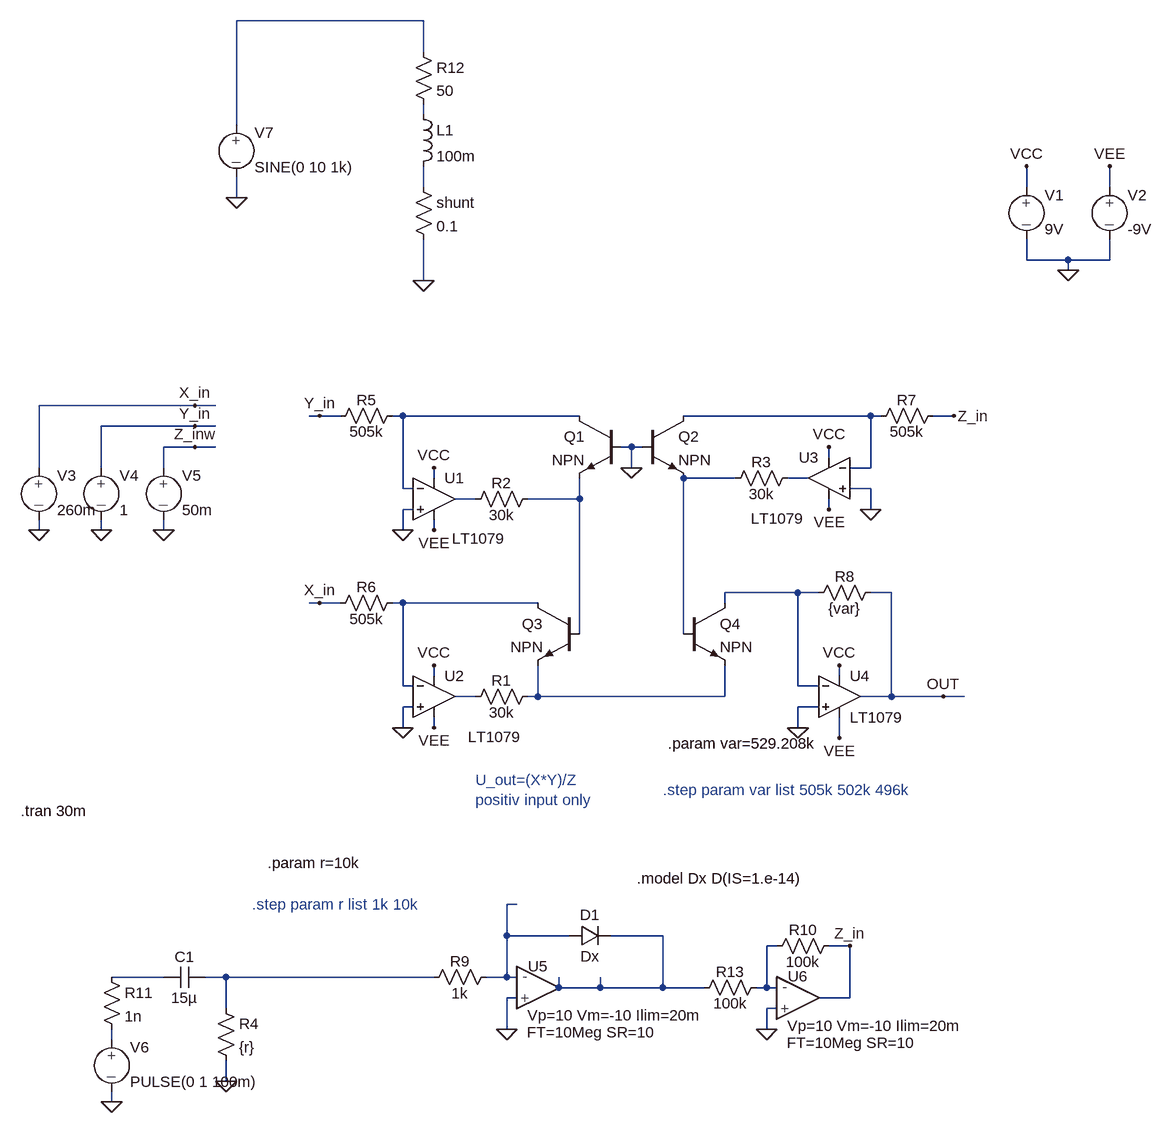
[diagram p0: schematic Multiplier.asc]
Multiplier.asc, the LTspice schematic file:
Version 4
SHEET 1 936 1044
WIRE -192 -640 -480 -640
WIRE -192 -592 -192 -640
WIRE -192 -496 -192 -512
WIRE -480 -480 -480 -640
WIRE -192 -384 -192 -416
WIRE 736 -384 736 -416
WIRE 864 -384 864 -416
WIRE -480 -368 -480 -400
WIRE 736 -272 736 -304
WIRE 800 -272 736 -272
WIRE 864 -272 864 -304
WIRE 864 -272 800 -272
WIRE 800 -256 800 -272
WIRE -192 -240 -192 -304
WIRE -544 -48 -784 -48
WIRE -512 -48 -544 -48
WIRE -352 -32 -368 -32
WIRE -320 -32 -352 -32
WIRE -224 -32 -240 -32
WIRE 48 -32 -224 -32
WIRE 496 -32 208 -32
WIRE 512 -32 496 -32
WIRE 624 -32 592 -32
WIRE -544 -16 -688 -16
WIRE -512 -16 -544 -16
WIRE -544 16 -592 16
WIRE -512 16 -544 16
WIRE 128 16 112 16
WIRE 144 16 128 16
WIRE 432 32 432 16
WIRE -784 48 -784 -48
WIRE -688 48 -688 -16
WIRE -592 48 -592 16
WIRE 128 48 128 16
WIRE 496 48 496 -32
WIRE 496 48 464 48
WIRE -176 64 -176 48
WIRE 288 64 208 64
WIRE 400 64 368 64
WIRE -224 80 -224 -32
WIRE -208 80 -224 80
WIRE 496 80 464 80
WIRE -112 96 -144 96
WIRE 48 96 48 64
WIRE 48 96 -32 96
WIRE -208 112 -224 112
WIRE 432 112 432 96
WIRE 496 112 496 80
WIRE -784 144 -784 128
WIRE -688 144 -688 128
WIRE -592 144 -592 128
WIRE -224 144 -224 112
WIRE -176 144 -176 128
WIRE 384 240 272 240
WIRE 416 240 384 240
WIRE 528 240 496 240
WIRE -352 256 -368 256
WIRE -320 256 -352 256
WIRE -224 256 -240 256
WIRE -16 256 -224 256
WIRE 272 256 272 240
WIRE 48 304 48 96
WIRE 208 304 208 64
WIRE -176 368 -176 352
WIRE 448 368 448 352
WIRE -224 384 -224 256
WIRE -208 384 -224 384
WIRE 384 384 384 240
WIRE 416 384 384 384
WIRE -112 400 -144 400
WIRE -16 400 -16 352
WIRE -16 400 -32 400
WIRE 272 400 272 352
WIRE 272 400 -16 400
WIRE 528 400 528 240
WIRE 528 400 480 400
WIRE 608 400 528 400
WIRE 640 400 608 400
WIRE -208 416 -224 416
WIRE 416 416 384 416
WIRE -224 448 -224 416
WIRE -176 448 -176 432
WIRE 384 448 384 416
WIRE 448 464 448 432
WIRE -48 720 -64 720
WIRE -64 768 -64 720
WIRE 32 768 -64 768
WIRE 176 768 96 768
WIRE 352 784 336 784
WIRE 464 784 432 784
WIRE -592 832 -672 832
WIRE -496 832 -528 832
WIRE -176 832 -496 832
WIRE -64 832 -64 768
WIRE -64 832 -96 832
WIRE -48 832 -64 832
WIRE 16 848 16 832
WIRE 80 848 80 832
WIRE 80 848 16 848
WIRE 176 848 176 768
WIRE 176 848 80 848
WIRE 240 848 176 848
WIRE 336 848 336 784
WIRE 336 848 320 848
WIRE 352 848 336 848
WIRE -48 864 -64 864
WIRE 464 864 464 784
WIRE 464 864 416 864
WIRE -496 880 -496 832
WIRE 352 880 336 880
WIRE -64 912 -64 864
WIRE 336 912 336 880
WIRE -672 928 -672 912
WIRE -496 992 -496 960
WIRE -672 1024 -672 1008
FLAG 128 48 0
FLAG 800 -256 0
FLAG -224 448 0
FLAG -224 144 0
FLAG 384 448 0
FLAG 496 112 0
FLAG 736 -416 VCC
FLAG 432 16 VCC
FLAG 448 352 VCC
FLAG -176 352 VCC
FLAG -176 48 VCC
FLAG -176 144 VEE
FLAG -176 448 VEE
FLAG 432 112 VEE
FLAG 448 464 VEE
FLAG 608 400 OUT
FLAG -352 -32 Y_in
FLAG 624 -32 Z_in
FLAG -352 256 X_in
FLAG -592 144 0
FLAG -688 144 0
FLAG -784 144 0
FLAG -544 -48 X_in
FLAG -544 -16 Y_in
FLAG -544 16 Z_inw
FLAG 864 -416 VEE
FLAG -64 912 0
FLAG -496 992 0
FLAG -672 1024 0
FLAG 336 912 0
FLAG 464 784 Z_in
FLAG -480 -368 0
FLAG -192 -240 0
SYMBOL Opamps\\LT1079 -176 32 R0
WINDOW 3 28 125 Left 0
SYMATTR InstName U1
SYMBOL Opamps\\LT1079 -176 336 R0
WINDOW 3 52 126 Left 0
SYMATTR InstName U2
SYMBOL Opamps\\LT1079 432 0 M0
WINDOW 3 38 126 Left 0
SYMATTR InstName U3
SYMBOL Opamps\\LT1079 448 336 R0
SYMATTR InstName U4
SYMBOL EIT_Semiconductors\\npn 112 -32 M0
SYMATTR InstName Q1
SYMBOL EIT_Semiconductors\\npn 144 -32 R0
SYMATTR InstName Q2
SYMBOL EIT_Semiconductors\\npn 48 256 M0
SYMATTR InstName Q3
SYMBOL EIT_Semiconductors\\npn 208 256 R0
SYMATTR InstName Q4
SYMBOL res -128 416 R270
WINDOW 0 25 56 VTop 0
WINDOW 3 7 56 VBottom 0
SYMATTR InstName R1
SYMATTR Value 30k
SYMBOL res -128 112 R270
WINDOW 0 25 56 VTop 0
WINDOW 3 7 56 VBottom 0
SYMATTR InstName R2
SYMATTR Value 30k
SYMBOL res 272 80 R270
WINDOW 0 25 56 VTop 0
WINDOW 3 7 56 VBottom 0
SYMATTR InstName R3
SYMATTR Value 30k
SYMBOL res -224 -48 R90
WINDOW 0 7 56 VBottom 0
WINDOW 3 25 56 VTop 0
SYMATTR InstName R5
SYMATTR Value 505k
SYMBOL res -224 240 R90
WINDOW 0 7 56 VBottom 0
WINDOW 3 25 56 VTop 0
SYMATTR InstName R6
SYMATTR Value 505k
SYMBOL res 608 -48 R90
WINDOW 0 7 56 VBottom 0
WINDOW 3 25 56 VTop 0
SYMATTR InstName R7
SYMATTR Value 505k
SYMBOL res 512 224 R90
WINDOW 0 7 56 VBottom 0
WINDOW 3 25 56 VTop 0
SYMATTR InstName R8
SYMATTR Value {var}
SYMBOL source-V 736 -400 R0
WINDOW 123 0 0 Left 0
WINDOW 39 0 0 Left 0
SYMATTR InstName V1
SYMATTR Value 9V
SYMBOL source-V 864 -400 R0
SYMATTR InstName V2
SYMATTR Value -9V
SYMBOL source-V -784 32 R0
WINDOW 123 0 0 Left 0
WINDOW 39 0 0 Left 0
SYMATTR InstName V3
SYMATTR Value 260m
SYMBOL source-V -688 32 R0
SYMATTR InstName V4
SYMATTR Value 1
SYMBOL source-V -592 32 R0
SYMATTR InstName V5
SYMATTR Value 50m
SYMBOL source-V -672 912 R0
WINDOW 123 0 0 Left 0
WINDOW 39 0 0 Left 0
SYMATTR InstName V6
SYMATTR Value PULSE(0 1 100m)
SYMBOL cap -528 816 R90
WINDOW 0 0 32 VBottom 0
WINDOW 3 32 32 VTop 0
SYMATTR InstName C1
SYMATTR Value 15µ
SYMBOL res -512 864 R0
SYMATTR InstName R4
SYMATTR Value {r}
SYMBOL res -80 816 R90
WINDOW 0 7 56 VBottom 0
WINDOW 3 25 56 VTop 0
SYMATTR InstName R9
SYMATTR Value 1k
SYMBOL res -688 816 R0
SYMATTR InstName R11
SYMATTR Value 1n
SYMBOL EIT_Semiconductors\\op_3 -16 848 R0
SYMATTR InstName U5
SYMBOL diode 32 784 R270
WINDOW 0 32 32 VTop 0
WINDOW 3 0 32 VBottom 0
SYMATTR InstName D1
SYMATTR Value Dx
SYMBOL EIT_Semiconductors\\op_3 384 864 R0
SYMATTR InstName U6
SYMBOL res 448 768 R90
WINDOW 0 7 56 VBottom 0
WINDOW 3 25 56 VTop 0
SYMATTR InstName R10
SYMATTR Value 100k
SYMBOL res 336 832 R90
WINDOW 0 7 56 VBottom 0
WINDOW 3 25 56 VTop 0
SYMATTR InstName R13
SYMATTR Value 100k
SYMBOL source-V -480 -496 R0
WINDOW 123 0 0 Left 0
WINDOW 39 0 0 Left 0
SYMATTR InstName V7
SYMATTR Value SINE(0 10 1k)
SYMBOL res -208 -608 R0
SYMATTR InstName R12
SYMATTR Value 50
SYMBOL ind -208 -512 R0
SYMATTR InstName L1
SYMATTR Value 100m
SYMBOL res -208 -400 R0
SYMATTR InstName shunt
SYMATTR Value 0.1
TEXT 184 472 Left 0 !.param var=529.208k
TEXT -112 528 Left 0 ;U_out=(X*Y)/Z\npositiv input only
TEXT -812 576 Left 0 !.tran 30m
TEXT 176 544 Left 0 ;.step param var list 505k 502k 496k
TEXT -432 656 Left 0 !.param r=10k
TEXT -456 720 Left 0 ;.step param r list 1k 10k
TEXT 136 680 Left 0 !.model Dx D(IS=1.e-14)

The netlist it stands for:
* Multiplier.asc
XU1 0 N004 VCC VEE N008 LT1079  ; pins In+ In- V+ V- OUT
XU2 0 N011 VCC VEE N012 LT1079  ; pins In+ In- V+ V- OUT
XU3 0 N005 VCC VEE N007 LT1079  ; pins In+ In- V+ V- OUT
XU4 0 N010 VCC VEE OUT LT1079  ; pins In+ In- V+ V- OUT
Q1 N004 0 N009 0 NPN
Q2 N005 0 N006 0 NPN
Q3 N011 N009 N013 0 NPN
Q4 N010 N006 N013 0 NPN
R1 N012 N013 30k
R2 N008 N009 30k
R3 N006 N007 30k
R5 N004 Y_in 505k
R6 N011 X_in 505k
R7 Z_in N005 505k
R8 OUT N010 {var}
V1 VCC 0 9V
V2 VEE 0 -9V
V3 X_in 0 260m
V4 Y_in 0 1
V5 Z_inw 0 50m
V6 N019 0 PULSE(0 1 100m)
C1 N018 N017 15µ
R4 N018 0 {r}
R9 N014 N018 1k
R11 N017 N019 1n
XU5 0 N014 N015 opamp_param_3 Vp=10 Vm=-10 Ilim=20m FT=10Meg SR=10 Vos=0 A0=100k phir=45 en=0 enk=0 in=0 ink=0 Rin=500Meg  ; pins In+ In- OUT
D1 N014 N015 Dx
XU6 0 N016 Z_in opamp_param_3 Vp=10 Vm=-10 Ilim=20m FT=10Meg SR=10 Vos=0 A0=100k phir=45 en=0 enk=0 in=0 ink=0 Rin=500Meg  ; pins In+ In- OUT
R10 Z_in N016 100k
R13 N016 N015 100k
V7 N001 0 SINE(0 10 1k)
R12 N001 N002 50
L1 N002 N003 100m
R§shunt N003 0 0.1
.model D D
.lib standard.dio
.model NPN NPN
.model PNP PNP
.lib standard.bjt
.param var=529.208k
* U_out=(X*Y)/Z
* positiv input only
.tran 30m
* .step param var list 505k 502k 496k
.param r=10k
* .step param r list 1k 10k
.model Dx D(IS=1.e-14)
.lib EIT_sub\opamp_parametrierbar.sub
.backanno
.end